# Altium project Player.PrjPcb (part 2 of 2)

## Sheet EMMC.SchDoc
size A4 portrait; SheetNumber: 5; SheetTotal: 9
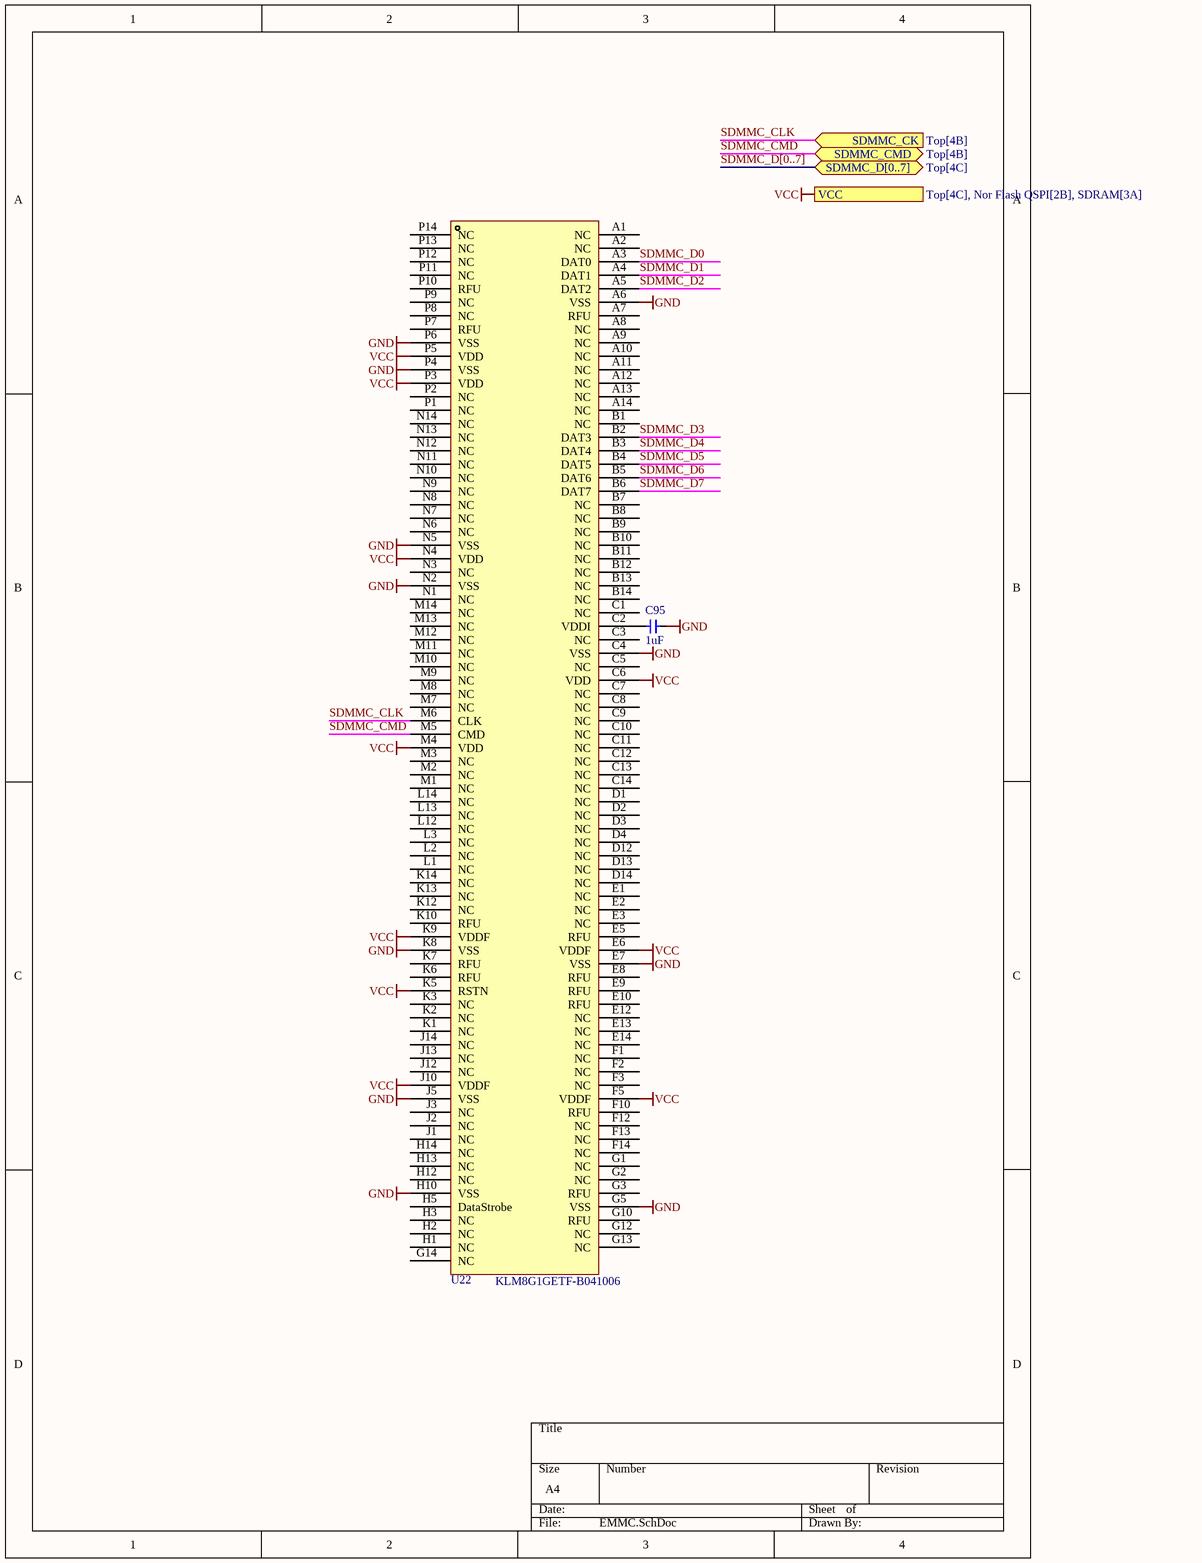
[diagram p6: EMMC.SchDoc]

### Parts
C95  1uF  [0402-C]
U22  KLM8G1GETF-B041006  [FBGA-153_L13.0-W11.5-P0.50_KLMAG1JETD-B041]

### Ports
SDMMC_CK (in, see Top[4B]), SDMMC_CMD (bidir, see Top[4B]), SDMMC_D[0..7] (bidir, see Top[4C]), VCC (see Top[4C], Nor Flash QSPI[2B], SDRAM[3A])

### Nets
GND: C95.2 U22.A6(VSS) U22.C4(VSS) U22.E7(VSS) U22.G5(VSS) U22.H10(VSS) U22.J5(VSS) U22.K8(VSS) U22.N2(VSS) U22.N5(VSS) U22.P4(VSS) U22.P6(VSS)  [project net Audio_RT1]
VCC: U22.C6(VDD) U22.E6(VDDF) U22.F5(VDDF) U22.J10(VDDF) U22.K5(RSTN) U22.K9(VDDF) U22.M4(VDD) U22.N4(VDD) U22.P3(VDD) U22.P5(VDD) ; port VCC
SDMMC_CLK: U22.M6(CLK) ; port SDMMC_CK
SDMMC_CMD: U22.M5(CMD) ; port SDMMC_CMD
SDMMC_D0: U22.A3(DAT0)
SDMMC_D1: U22.A4(DAT1)
SDMMC_D2: U22.A5(DAT2)
SDMMC_D3: U22.B2(DAT3)
SDMMC_D4: U22.B3(DAT4)
SDMMC_D5: U22.B4(DAT5)
SDMMC_D6: U22.B5(DAT6)
SDMMC_D7: U22.B6(DAT7)
NetC95_1: C95.1 U22.C2(VDDI)

Not connected (* = marked no-connect by the designer): U22 A1(NC) A2(NC) A7(RFU) A8(NC) A9(NC) A10(NC) A11(NC) A12(NC) A13(NC) A14(NC) B1(NC) B7(NC) B8(NC) B9(NC) B10(NC) B11(NC) B12(NC) B13(NC) B14(NC) C1(NC) C3(NC) C5(NC) C7(NC) C8(NC) C9(NC) C10(NC) C11(NC) C12(NC) C13(NC) C14(NC) D1(NC) D2(NC) D3(NC) D4(NC) D12(NC) D13(NC) D14(NC) E1(NC) E2(NC) E3(NC) E5(RFU) E8(RFU) E9(RFU) E10(RFU) E12(NC) E13(NC) E14(NC) F1(NC) F2(NC) F3(NC) F10(RFU) F12(NC) F13(NC) F14(NC) G1(NC) G2(NC) G3(RFU) G10(RFU) G12(NC) G13(NC) G14(NC) H1(NC) H2(NC) H3(NC) H5(DataStrobe) H12(NC) H13(NC) H14(NC) J1(NC) J2(NC) J3(NC) J12(NC) J13(NC) J14(NC) K1(NC) K2(NC) K3(NC) K6(RFU) K7(RFU) K10(RFU) K12(NC) K13(NC) K14(NC) L1(NC) L2(NC) L3(NC) L12(NC) L13(NC) L14(NC) M1(NC) M2(NC) M3(NC) M7(NC) M8(NC) M9(NC) M10(NC) M11(NC) M12(NC) M13(NC) M14(NC) N1(NC) N3(NC) N6(NC) N7(NC) N8(NC) N9(NC) N10(NC) N11(NC) N12(NC) N13(NC) N14(NC) P1(NC) P2(NC) P7(RFU) P8(NC) P9(NC) P10(RFU) P11(NC) P12(NC) P13(NC) P14(NC)

### Buses and harness runs
bus SDMMC_D[0..7] = port SDMMC_D[0..7]

### Library data of the parts
C95 = 电容-0402: Capacitor; Value: 0.1u
U22 = KLM8G1GETF-B041006: Manufacturer: SAMSUNG(三星半导体); Symbol: KLM8G1GETF-B041006_C20622996; Device: KLM8G1GETF-B041006_1; Add into BOM: yes; LCSC Part Name: KLM8G1GETF-B041006; Supplier Part: C20622996; Manufacturer Part: KLM8G1GETF-B041006; Supplier Footprint: FBGA-153(11.5x13); Datasheet: https://atta.szlcsc.com/upload/public/pdf/source/20240221/0DCF3FBB535A67C02EC39E54F7AEA7E4.pdf; Supplier: LCSC; Convert to PCB: yes

## Sheet Audio-HiFi.SchDoc
size A4; SheetNumber: 7; SheetTotal: 9
Used 2 times, as channels Designator/Audio I/V, Designator/Audio I/V. Parts and nets are listed once, with the designators drawn on the sheet.
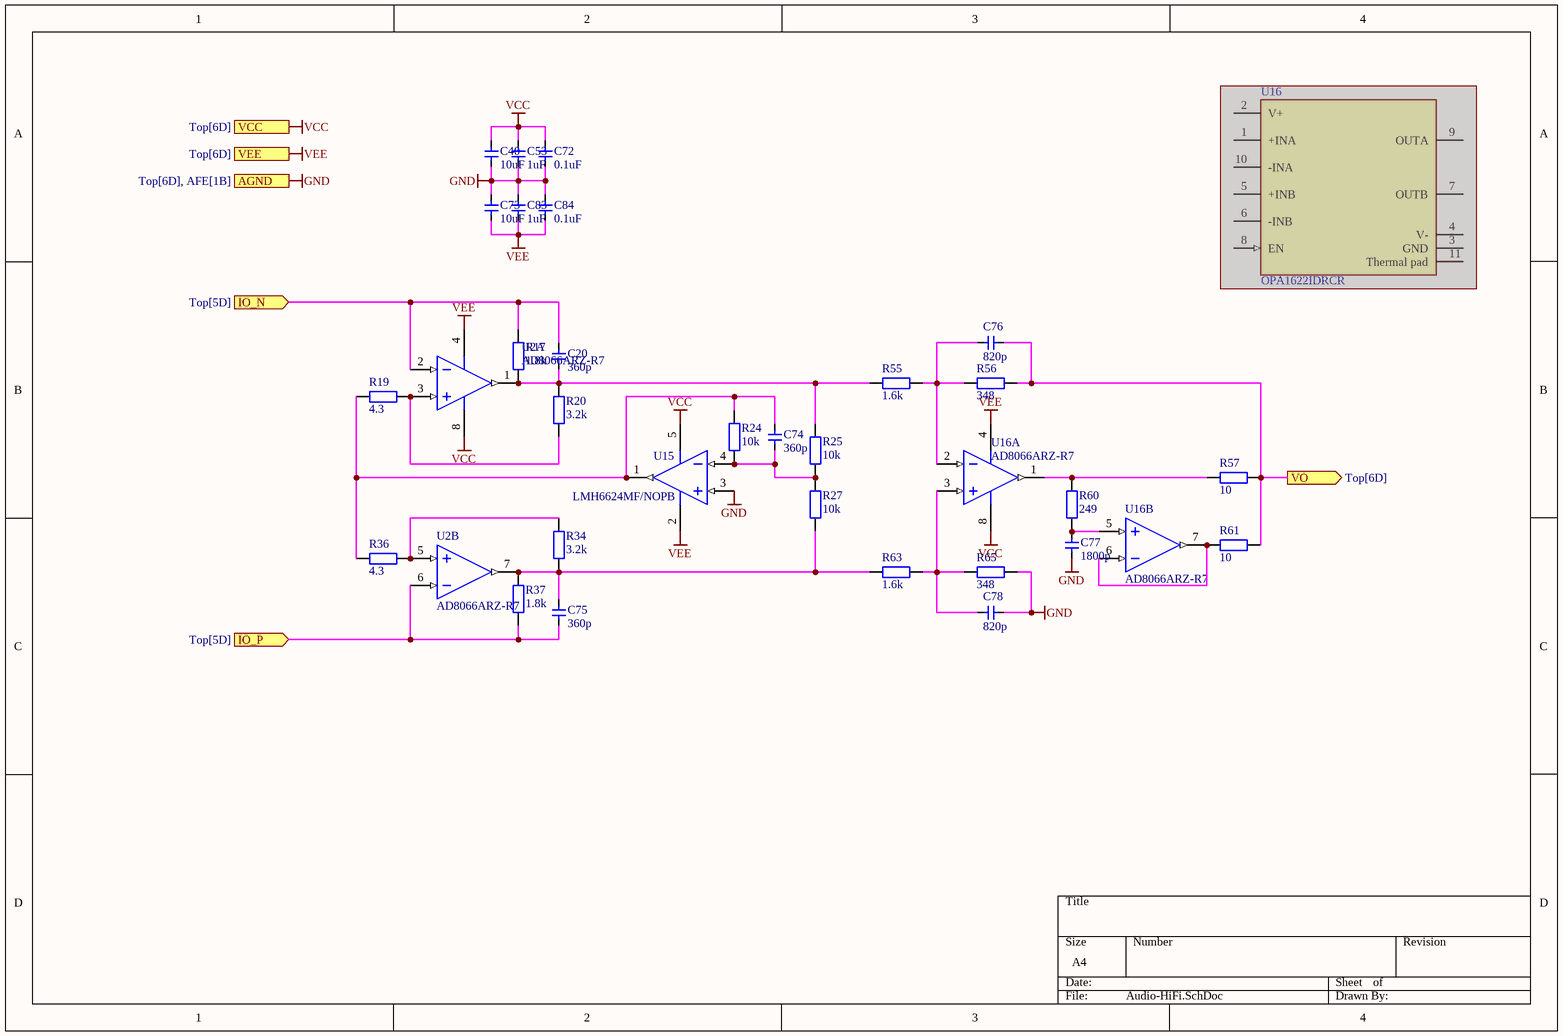
[diagram p7: Audio-HiFi.SchDoc]

### Parts
(Parts that share a designator on the sheet are numbered #1, #2 ... from top to bottom, then left to right.)
C20  360p  [0402-C]
C40  10uF  [0402-C]
C53  1uF  [0402-C]
C72  0.1uF  [0402-C]
C73  10uF  [0402-C]
C74  360p  [0402-C]
C75  360p  [0402-C]
C76  820p  [0402-C]
C77  1800p  [0402-C]
C78  820p  [0402-C]
C83  1uF  [0402-C]
C84  0.1uF  [0402-C]
R17  1.8k  [0402-R]
R19  4.3  [0402-R]
R20  3.2k  [0402-R]
R24  10k  [0402-R]
R25  10k  [0402-R]
R27  10k  [0402-R]
R34  3.2k  [0402-R]
R36  4.3  [0402-R]
R37  1.8k  [0402-R]
R55  1.6k  [0402-R]
R56  348  [0402-R]
R57  10  [0402-R]
R60  249  [0402-R]
R61  10  [0402-R]
R63  1.6k  [0402-R]
R65  348  [0402-R]
U2  AD8066ARZ-R7  [DFN-8_L3.0-W3.0-P0.50-BL-EP]  (parts A,B of 2)
U15  LMH6624MF/NOPB  [DBV0005A_L]
U16#1  OPA1622IDRCR  [FP-DRC0010J-IPC_A]  (masked out: inside a compile mask, not in the netlist)
U16#2  AD8066ARZ-R7  [DFN-8_L3.0-W3.0-P0.50-BL-EP]  (parts A,B of 2)

### Ports
AGND (see Top[6D], AFE[1B]), IO_N (in, see Top[5D]), IO_P (in, see Top[5D]), VCC (see Top[6D]), VEE (see Top[6D]), VO (out, see Top[6D])

### Nets
GND: C40.2 C53.2 C72.2 C73.1 C77.1 C78.1 C83.1 C84.1 R65.2 U15.3(IN+) ; port AGND
VCC: C40.1 C53.1 C72.1 U2.8(+VS) U15.5(V+) U16#2.8(+VS) ; port VCC
VEE: C73.2 C83.2 C84.2 U2.4(-VS) U15.2(V-) U16#2.4(-VS) ; port VEE
IO_N: C20.2 R17.1 U2.2(-IN_1) ; port IO_N
IO_P: C75.1 R37.2 U2.6(-IN_2) ; port IO_P
VO: C76.1 R56.2 R57.2 R61.1 ; port VO
NetC20_1: C20.1 R17.2 R20.1 R25.1 R55.1 U2.1(VOUT_1)
NetC74_1: C74.1 R24.2 R25.2 R27.1 U15.4(IN-)
NetC74_2: C74.2 R19.1 R24.1 R36.1 U15.1(OUT)
NetC75_2: C75.2 R27.2 R34.2 R37.1 R63.1 U2.7(VOUT_2)
NetC76_2: C76.2 R55.2 R56.1 U16#2.2(-IN_1)
NetC77_2: C77.2 R60.2 U16#2.5(+IN_2)
NetC78_2: C78.2 R63.2 R65.1 U16#2.3(+IN_1)
NetR19_2: R19.2 R20.2 U2.3(+IN_1)
NetR34_1: R34.1 R36.2 U2.5(+IN_2)
NetR57_1: R57.1 R60.1 U16#2.1(VOUT_1)
NetR61_2: R61.2 U16#2.6(-IN_2) U16#2.7(VOUT_2)

### Channels
Designator/Audio I/V: designators C20=C20_Audio_I/V2 C40=C40_Audio_I/V2 C53=C53_Audio_I/V2 C72=C72_Audio_I/V2 C73=C73_Audio_I/V2 C74=C74_Audio_I/V2 C75=C75_Audio_I/V2 C76=C76_Audio_I/V2 C77=C77_Audio_I/V2 C78=C78_Audio_I/V2 C83=C83_Audio_I/V2 C84=C84_Audio_I/V2 R17=R17_Audio_I/V2 R19=R19_Audio_I/V2 R20=R20_Audio_I/V2 R24=R24_Audio_I/V2 R25=R25_Audio_I/V2 R27=R27_Audio_I/V2 R34=R34_Audio_I/V2 R36=R36_Audio_I/V2 R37=R37_Audio_I/V2 R55=R55_Audio_I/V2 R56=R56_Audio_I/V2 R57=R57_Audio_I/V2 R60=R60_Audio_I/V2 R61=R61_Audio_I/V2 R63=R63_Audio_I/V2 R65=R65_Audio_I/V2 U2=U2_Audio_I/V2 U15=U15_Audio_I/V2 U16=U16_Designator_Audio_I/V#1 U16=U16_Audio_I/V2; ports AGND=Audio_RT1 IO_N=NetC20_Audio_I/V1_2 IO_P=NetC75_Audio_I/V1_1 VCC=VCC VEE=VEE VO=NetC76_Audio_I/V1_1
Designator/Audio I/V: designators C20=C20_Audio_I/V1 C40=C40_Audio_I/V1 C53=C53_Audio_I/V1 C72=C72_Audio_I/V1 C73=C73_Audio_I/V1 C74=C74_Audio_I/V1 C75=C75_Audio_I/V1 C76=C76_Audio_I/V1 C77=C77_Audio_I/V1 C78=C78_Audio_I/V1 C83=C83_Audio_I/V1 C84=C84_Audio_I/V1 R17=R17_Audio_I/V1 R19=R19_Audio_I/V1 R20=R20_Audio_I/V1 R24=R24_Audio_I/V1 R25=R25_Audio_I/V1 R27=R27_Audio_I/V1 R34=R34_Audio_I/V1 R36=R36_Audio_I/V1 R37=R37_Audio_I/V1 R55=R55_Audio_I/V1 R56=R56_Audio_I/V1 R57=R57_Audio_I/V1 R60=R60_Audio_I/V1 R61=R61_Audio_I/V1 R63=R63_Audio_I/V1 R65=R65_Audio_I/V1 U2=U2_Audio_I/V1 U15=U15_Audio_I/V1 U16=U16_Designator_Audio_I/V#2 U16=U16_Audio_I/V1; ports AGND=Audio_RT1 IO_N=NetC20_Audio_I/V1_2 IO_P=NetC75_Audio_I/V1_1 VCC=VCC VEE=VEE VO=NetC76_Audio_I/V1_1

### Library data of the parts
C20 C40 C53 C72-C78 C83 C84 = 电容-0402: Capacitor; Value: 0.1u
R17 R19 R20 R24 R25 R27 R34 R36 R37 R55-R57 R60 R61 R63 R65 = R: 贴片电阻; 联系下单店铺卖家 免费帮你查找封装: 联系下单店铺卖家 免费技术支持; BOM名称: 贴片电阻
U2 U16#2 = AD8066ARZ-R7: Double Channel Low Power Operational Amplifier, 145 MHz BW, 180 V/us SR, Industrial, 8-pin SOIC (R-8), Reel; Manufacturer: Analog Devices; Generic Part Number: AD8066; Small Signal Bandwidth: 145MHz; V Span Min: 5V; Input Offset Voltage: 400uV; V Span Max: 24V; Input Bias Current: 2pA; Amplifiers Per Package: 2; Iq/Amp: 7.4mA; ComponentLink1URL: http://www.analog.com/en/index.html; ComponentLink4Description: Reference Circuit; ComponentLink3URL: http://www.analog.com/static/imported-files/packages/PKG_PDF/SOIC_Narrow%20(R)/R_8.pdf; Code_JEDEC: MS-012-AA; ComponentLink3Description: Package Specification; ComponentLink4URL: http://www.analog.com/en/all-operational-amplifiers-op-amps/operational-amplifiers-op-amps/ad8066/products/product.html#product-recommendations; RevisionNote: Reference Circuit URL fixed; ComponentLink1Description: Manufacturer URL; PackageDescription: 8-Pin Standard Small Outline Package, Body 3.9 x 4.9 mm, Pitch 1.27 mm; PackageReference: R-8; Slew Rate: 180V/us; PackageVersion: 060506-A; Mounting Technology: Surface Mount; ComponentLink2Description: Datasheet; ComponentLink2URL: http://www.analog.com/static/imported-files/data_sheets/AD8065_8066.pdf; PartNumber: AD8066ARZ-R7; DatasheetVersion: Rev. J
U15 = CMP-0055-01252-3: Single/ Dual Ultra Low Noise Wideband Operational Amplifier, 5-pin SOT-23, Pb-Free; Manufacturer: Texas Instruments; CompType: Amplifiers; PowerWise: Y; PackageTopMarking: A94A*XTT; PinCount: 5; ComponentLink1URL: http://www.ti.com/general/docs/lit/getliterature.tsp?genericPartNumber=LMH6624&fileType=pdf; RoHS: Y; Package Reference: DBV0005A; ComponentLink1Description: Datasheet URL; PackageDescription: Molded SOT-23, .115 x .063 x .040 in Body, 5 Lead, .0375 in Pitch
U16#1 = CMP-04895-000274-1: IC AUDIO 2 CIRCUIT 10VSON; Gain Bandwidth Product: 32MHz; Number of Channels: 2; Max Output Power: 100mW; Min Operating Temperature: -40°C; Max Operating Temperature: 125°C; RoHS Compliant: Yes; Mount: Surface Mount; Packaging: Tape and Reel; Lead Free: Lead Free

## Nets that join several sheets
Audio_RT1: Top (106 pins), MCU (70 pins), AFE (40 pins), Nor Flash QSPI (U1.0 U1.4), EMMC (12 pins), Designator/Audio I/V (10 pins), Designator/Audio I/V (10 pins)
VCC: AFE (8 pins), Nor Flash QSPI (R1.1 U1.8), EMMC (10 pins), Designator/Audio I/V (6 pins), Designator/Audio I/V (6 pins)
VDCDC1: Top (14 pins), MCU (34 pins)
VEE: Designator/Audio I/V (6 pins), Designator/Audio I/V (6 pins)
NetC20_Audio_I/V1_2: Designator/Audio I/V (C20_Audio_I/V2.2 R17_Audio_I/V2.1 U2_Audio_I/V2.2), Designator/Audio I/V (C20_Audio_I/V1.2 R17_Audio_I/V1.1 U2_Audio_I/V1.2)
NetC75_Audio_I/V1_1: Designator/Audio I/V (C75_Audio_I/V2.1 R37_Audio_I/V2.2 U2_Audio_I/V2.6), Designator/Audio I/V (C75_Audio_I/V1.1 R37_Audio_I/V1.2 U2_Audio_I/V1.6)
NetC76_Audio_I/V1_1: Designator/Audio I/V (C76_Audio_I/V2.1 R56_Audio_I/V2.2 R57_Audio_I/V2.2 R61_Audio_I/V2.1), Designator/Audio I/V (C76_Audio_I/V1.1 R56_Audio_I/V1.2 R57_Audio_I/V1.2 R61_Audio_I/V1.1)
NetU1_6: AFE (U10.11), Nor Flash QSPI (U1.6)

## Assembly variants
Variant of SignalRanger-V0.1-Alpha: all parts fitted